# EAGLE design triax-arm-quad-mmcx-passthrough (EAGLE 8.4.1)
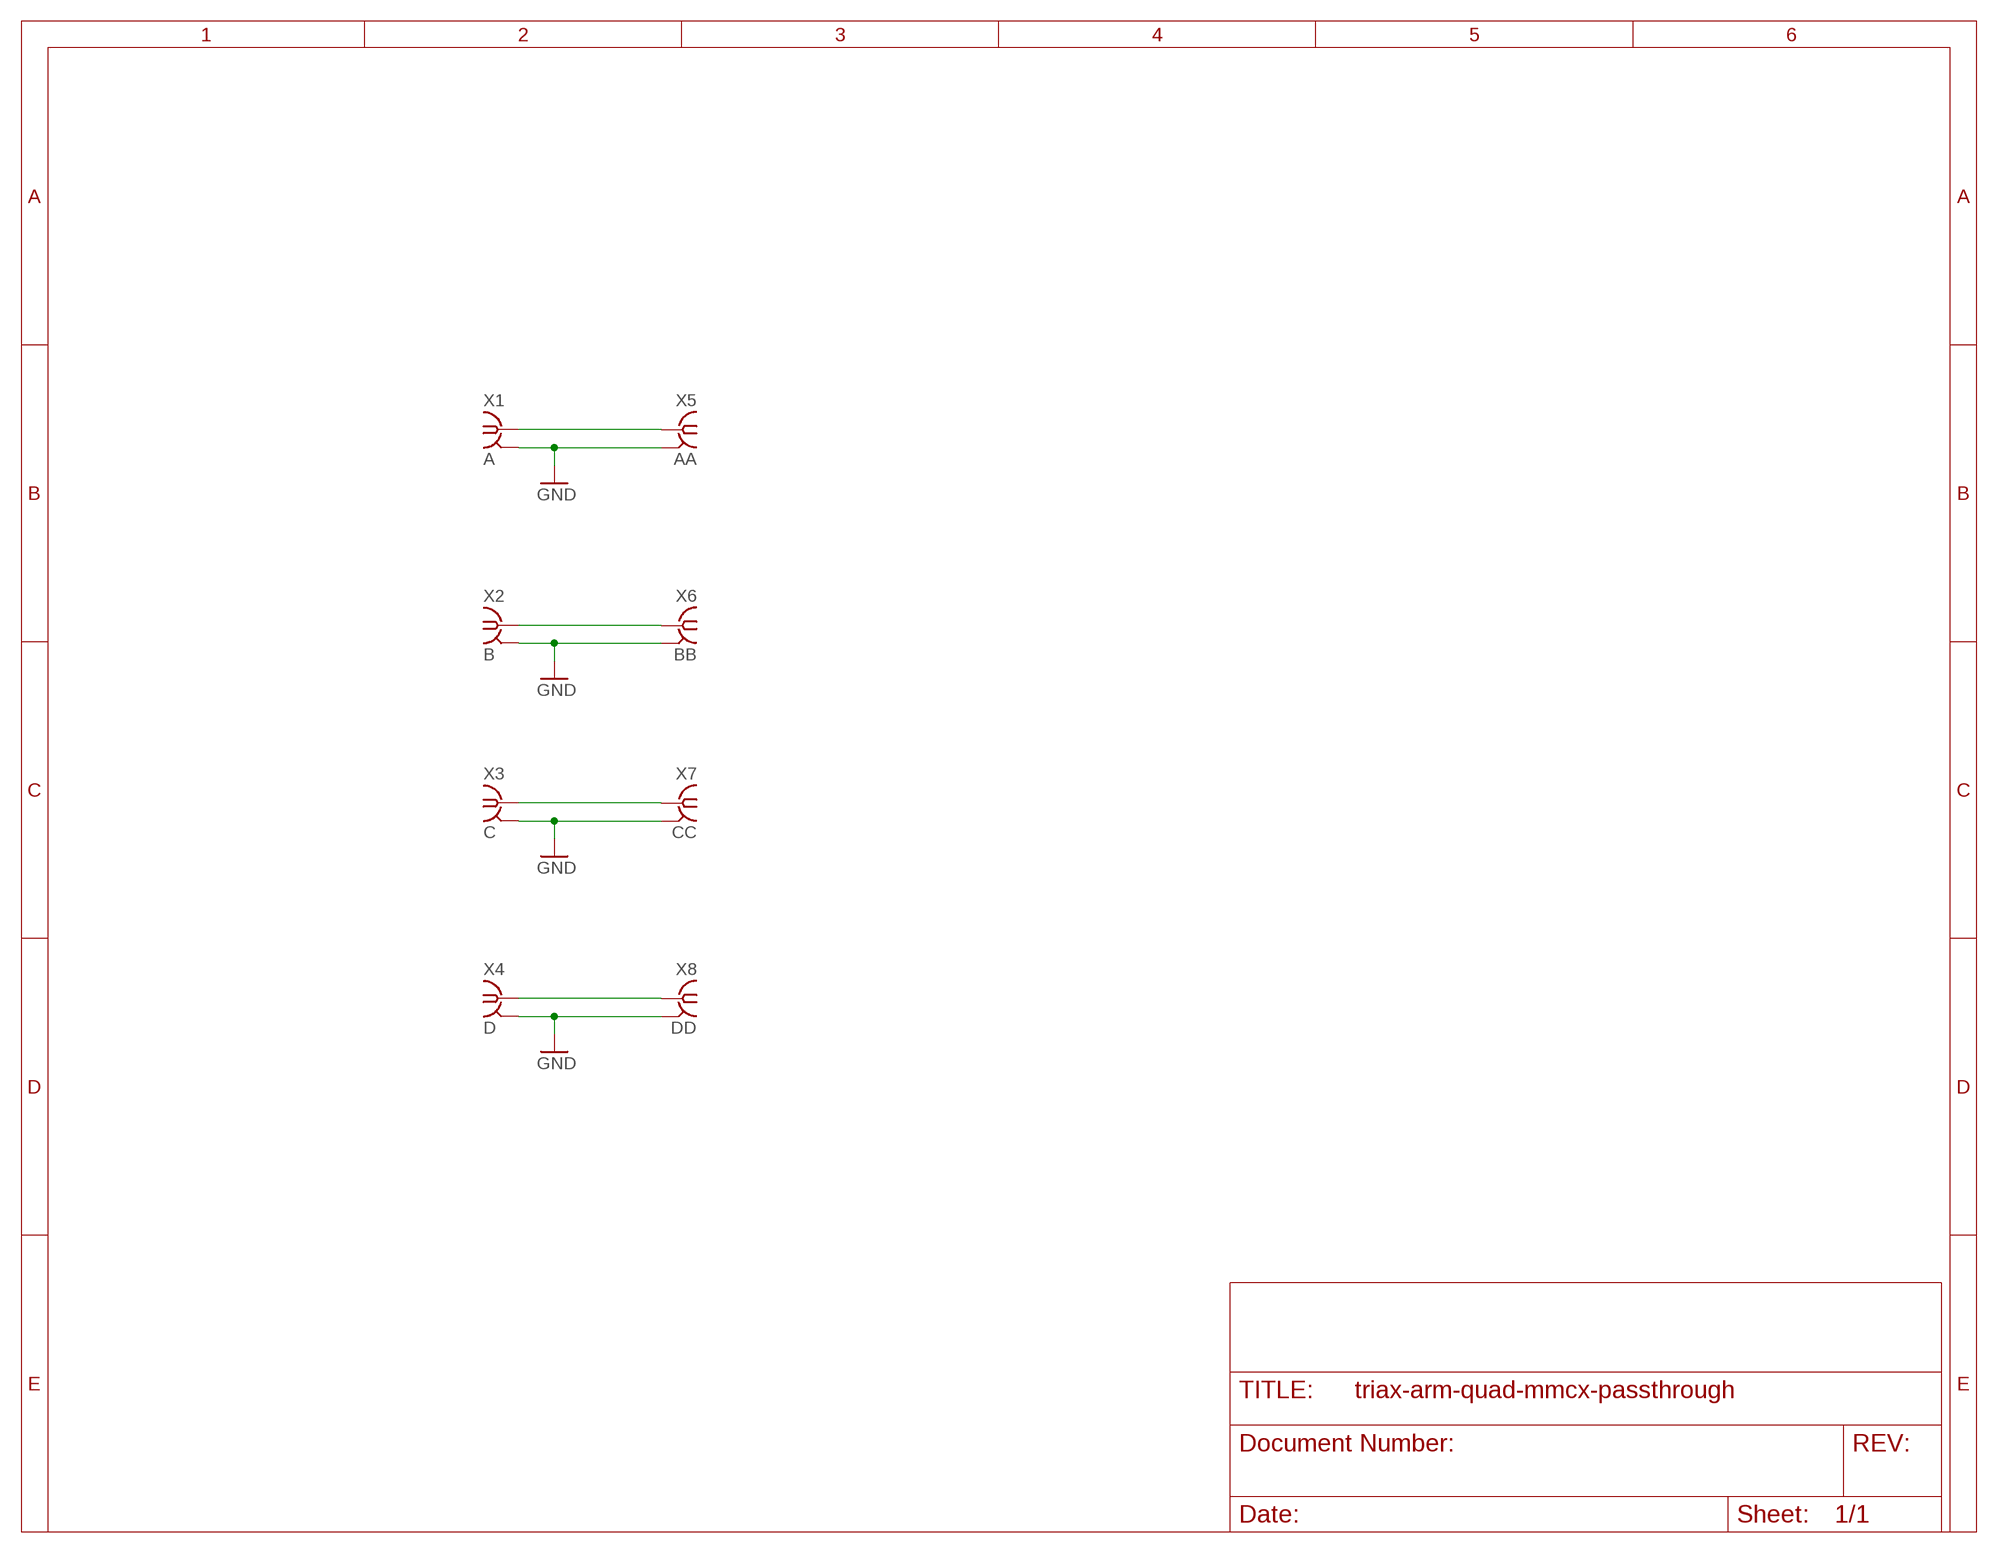
[diagram p0: schematic, sheet 1]

## Parts
X1  A  COAX  [MMCX-J-P-X-ST-EM1-MKT]
X2  B  COAX  [MMCX-J-P-X-ST-EM1-MKT]
X3  C  COAX  [MMCX-J-P-X-ST-EM1-MKT]
X4  D  COAX  [MMCX-J-P-X-ST-EM1-MKT]
X5  AA  COAX  [MMCX-J-P-X-ST-EM1-MKT]
X6  BB  COAX  [MMCX-J-P-X-ST-EM1-MKT]
X7  CC  COAX  [MMCX-J-P-X-ST-EM1-MKT]
X8  DD  COAX  [MMCX-J-P-X-ST-EM1-MKT]

## Nets
A: X1.1 X5.1
B: X2.1 X6.1
C: X3.1 X7.1
D: X4.1 X8.1
GND: X1.2@1(GND) X2.2@1(GND) X3.2@1(GND) X4.2@1(GND) X5.2@1(GND) X6.2@1(GND) X7.2@1(GND) X8.2@1(GND)

## Power pins joined to a net without a drawn wire
GND: X1.2@2(GND) X1.2@3(GND) X1.2@4(GND) X2.2@2(GND) X2.2@3(GND) X2.2@4(GND) X3.2@2(GND) X3.2@3(GND) X3.2@4(GND) X4.2@2(GND) X4.2@3(GND) X4.2@4(GND) X5.2@2(GND) X5.2@3(GND) X5.2@4(GND) X6.2@2(GND) X6.2@3(GND) X6.2@4(GND) X7.2@2(GND) X7.2@3(GND) X7.2@4(GND) X8.2@2(GND) X8.2@3(GND) X8.2@4(GND)

## Library data of the parts
X1-X8 = con-samtec:COAX: MMCX STRAIGHT, EDGE MOUNT JACK- 50 OHM Source: http://www.samtec.com/ftppub/cpdf/MMCX-J-P-X-ST-EM1-MKT.pdf; OC_FARNELL: unknown; OC_NEWARK: unknown

## Board
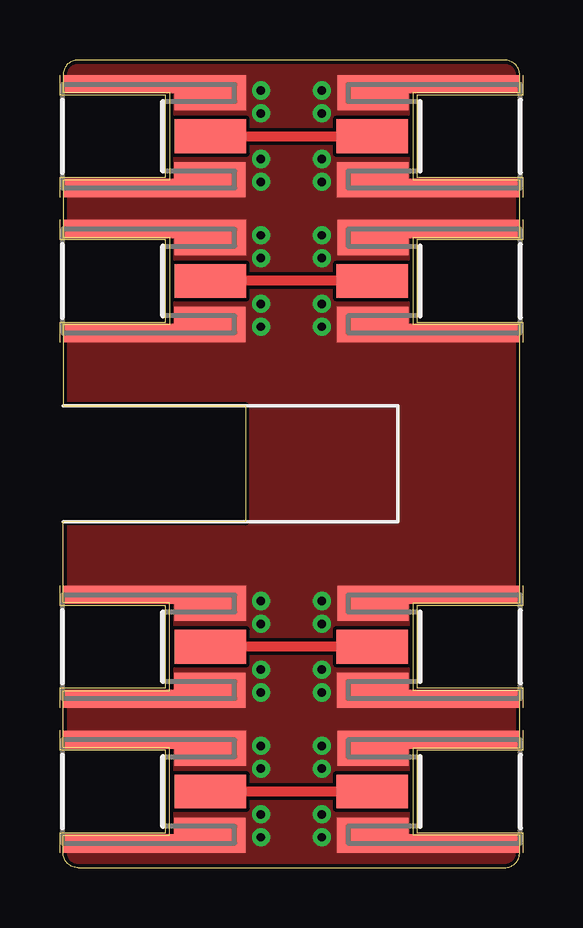
[diagram p1: board, top side]
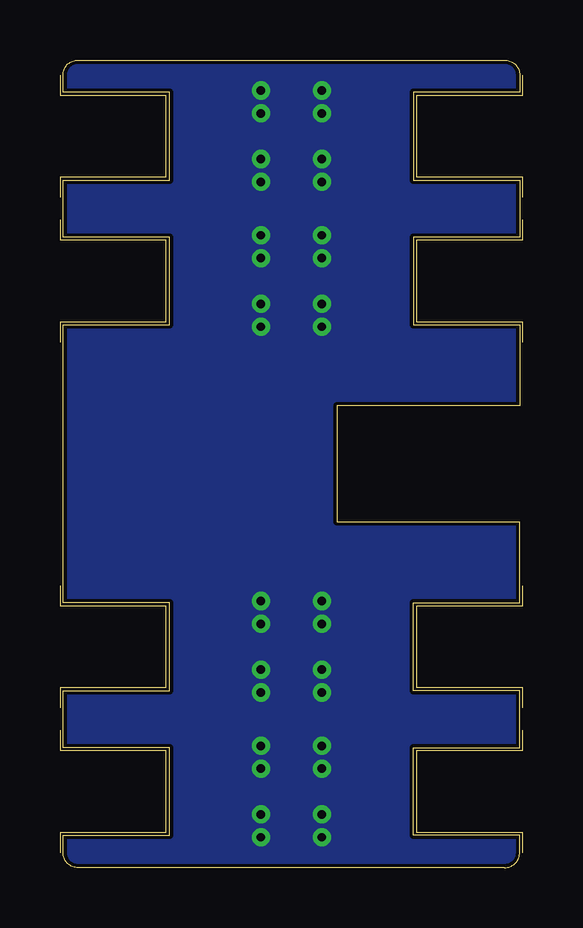
[diagram p2: board, bottom side, seen from below]

Size 19.05 x 33.66 mm. Coordinates in mm from the lower left corner, seen from the top.
Outline: 0.64,0 18.41,0 arc90 19.05,0.64 19.05,1.35 14.61,1.35 14.61,5 19.05,5 19.05,7.38 14.61,7.38 14.61,11.03 19.05,11.03 19.05,22.62 14.61,22.62 14.61,26.27 19.05,26.27 19.05,28.66 14.61,28.66 14.61,32.31 19.05,32.31 19.05,33.02 arc90 18.41,33.66 0.64,33.66 arc90 0,33.02 0,32.31 4.45,32.31 4.45,28.66 0,28.66 0,26.27 4.45,26.27 4.45,22.62 0,22.62 0,19.24 7.62,19.24 7.62,14.41 0,14.41 0,11.03 4.45,11.03 4.45,7.38 0,7.38 0,5 4.45,5 4.45,1.35 0,1.35 0,0.64 arc90 0.64,0
Copper layers (1*16): Top 0.035mm / dielectric 1.5mm / Bottom 0.035mm
Design rules "default *": minimum track width 6mil, minimum drill 0.35mm, track to track 6mil, track to pad 6mil, pad to pad 6mil, via to via 6mil, smd to smd 6mil, copper to edge 6mil, drill to drill 6mil, minimum pad ring 10mil, minimum via ring 8mil, stop-mask expansion 4mil, vias tented up to drill 0mil, thermal gap 10mil
tKeepout: 4 lines

### Footprints (pad centres in the part's own frame; a part is rotated, then mirrored left to right if it is on the bottom)
MMCX-J-P-X-ST-EM1-MKT = smd 1.4 x 2.975: 1 0,-6.15 | smd 1.46 x 2.975: 2@1 -1.812,-6.125; 2@2 1.812,-6.138 | smd 0.76 x 4.7: 2@3 -2.163,-2.35; 2@4 2.163,-2.35

### Placement (x,y rotation side)
X1  0,30.48 90 top
X2  0,24.45 90 top
X3  0,9.21 90 top
X4  0,3.18 90 top
X5  19.05,30.48 270 top
X6  19.05,24.45 270 top
X7  19.05,9.21 270 top
X8  19.05,3.18 270 top

### Tracks (layer width: path | path; a pad name or v marks a point on that pad's centre or on a via)
A
  Top 0.406: X1.1 X5.1
B
  Top 0.406: X6.1 X2.1
C
  Top 0.406: X7.1 X3.1
D
  Top 0.406: X8.1 X4.1
GND  (via drill 0.35)
  other vias: 8.26,32.39 10.79,32.39 8.26,31.43 10.79,31.43 10.79,29.53 8.26,29.53 8.26,28.58 10.79,28.58 8.26,25.4 8.26,26.35 10.79,25.4 10.79,26.35 10.79,23.5 10.79,22.54 8.26,23.5 8.26,22.54 8.26,10.16 8.26,11.11 10.79,10.16 10.79,11.11 8.26,8.26 8.26,7.3 10.79,8.26 10.79,7.3 8.26,4.13 8.26,5.08 10.79,5.08 10.79,4.13 10.79,2.22 10.79,1.27 8.26,1.27 8.26,2.22
  pour Top (no thermals): -0.64,-0.63 -0.64,34.29 19.68,34.29 19.68,-0.63
  pour Bottom: -0.32,33.97 19.37,33.97 19.37,-0.32 -0.32,-0.32